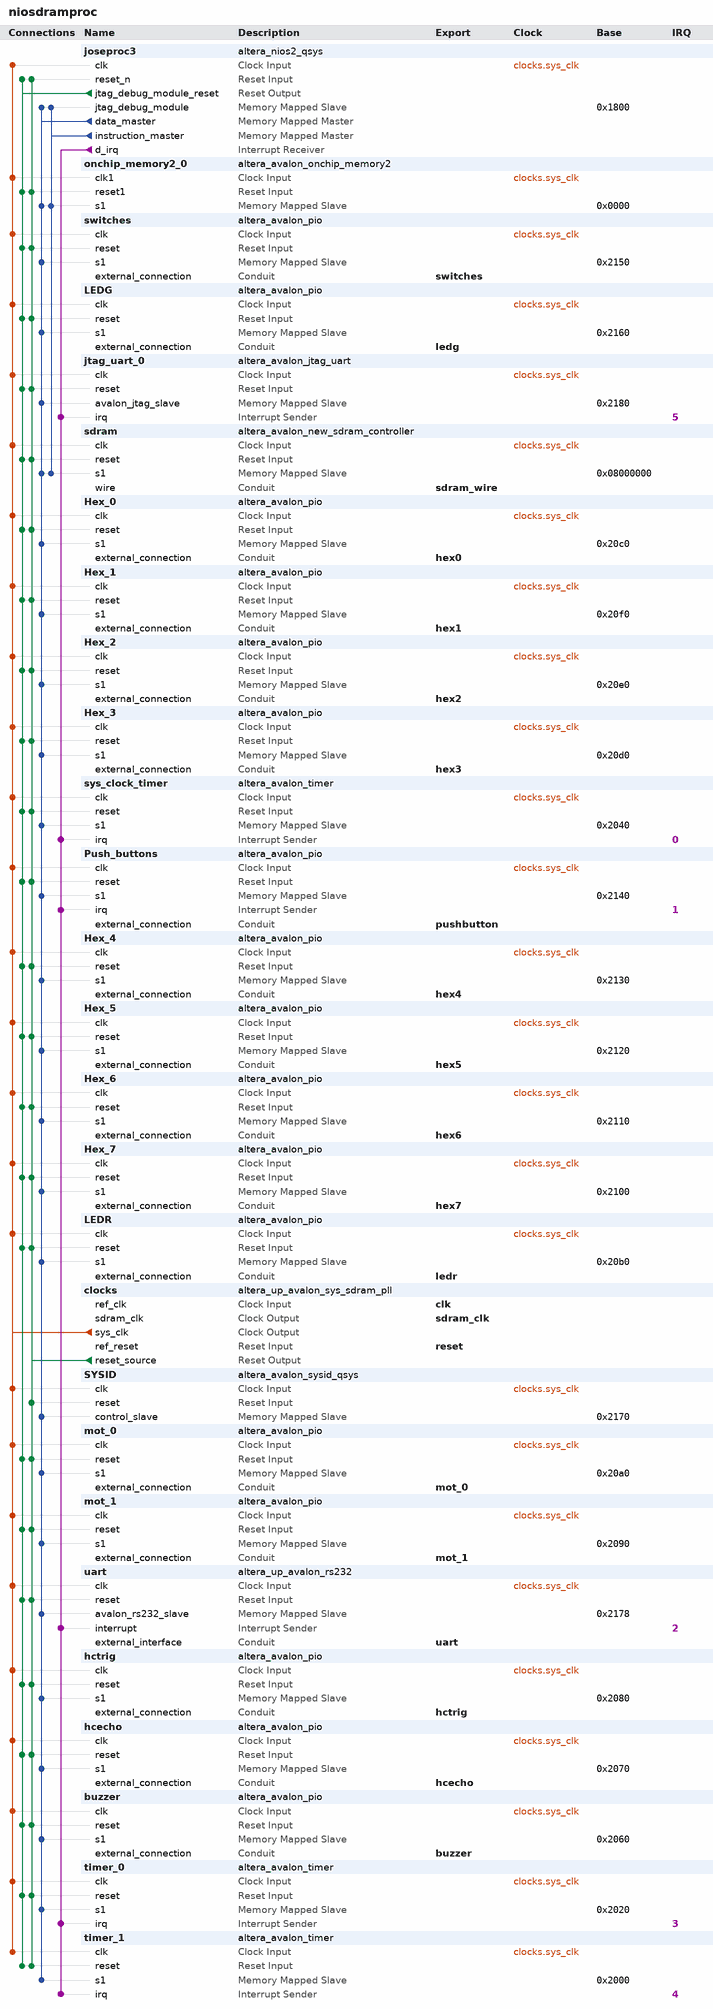
[diagram p0: system contents]
# Platform Designer (Qsys) system niosdramproc, Cyclone IV E EP4CE115F29C7
# Parameters at their usual value, and those the tool derives, are not listed.
package require -exact qsys 17.1
create_system niosdramproc
set_project_property DEVICE_FAMILY {Cyclone IV E}
set_project_property DEVICE EP4CE115F29C7

add_instance joseproc3 altera_nios2_qsys 16.1
set_instance_parameter_value joseproc3 breakSlave joseproc3.jtag_debug_module
set_instance_parameter_value joseproc3 exceptionSlave sdram.s1
set_instance_parameter_value joseproc3 icache_size 4096
set_instance_parameter_value joseproc3 impl Fast
set_instance_parameter_value joseproc3 mmu_TLBMissExcSlave None
set_instance_parameter_value joseproc3 resetSlave sdram.s1
set_instance_parameter_value joseproc3 resetrequest_enabled true

add_instance onchip_memory2_0 altera_avalon_onchip_memory2 17.1
set_instance_parameter_value onchip_memory2_0 dataWidth 32
set_instance_parameter_value onchip_memory2_0 dualPort false
set_instance_parameter_value onchip_memory2_0 initMemContent true
set_instance_parameter_value onchip_memory2_0 initializationFileName onchip_mem.hex
set_instance_parameter_value onchip_memory2_0 memorySize 4096

add_instance switches altera_avalon_pio 17.1
set_instance_parameter_value switches direction Input
set_instance_parameter_value switches width 18

add_instance LEDG altera_avalon_pio 17.1
set_instance_parameter_value LEDG direction Output
set_instance_parameter_value LEDG width 9

add_instance jtag_uart_0 altera_avalon_jtag_uart 17.1
set_instance_parameter_value jtag_uart_0 simInteractiveOptions NO_INTERACTIVE_WINDOWS

add_instance sdram altera_avalon_new_sdram_controller 17.1
set_instance_parameter_value sdram TAC 5.5
set_instance_parameter_value sdram TRCD 15.0
set_instance_parameter_value sdram TRP 15.0
set_instance_parameter_value sdram casLatency 3
set_instance_parameter_value sdram columnWidth 10
set_instance_parameter_value sdram dataWidth 32
set_instance_parameter_value sdram generateSimulationModel false
set_instance_parameter_value sdram model single_Micron_MT48LC4M32B2_7_chip
set_instance_parameter_value sdram numberOfBanks 4
set_instance_parameter_value sdram numberOfChipSelects 1
set_instance_parameter_value sdram powerUpDelay 100.0
set_instance_parameter_value sdram refreshPeriod 7.8125
set_instance_parameter_value sdram rowWidth 13

add_instance Hex_0 altera_avalon_pio 17.1
set_instance_parameter_value Hex_0 direction Output
set_instance_parameter_value Hex_0 width 7

add_instance Hex_1 altera_avalon_pio 17.1
set_instance_parameter_value Hex_1 direction Output
set_instance_parameter_value Hex_1 width 7

add_instance Hex_2 altera_avalon_pio 17.1
set_instance_parameter_value Hex_2 direction Output
set_instance_parameter_value Hex_2 width 7

add_instance Hex_3 altera_avalon_pio 17.1
set_instance_parameter_value Hex_3 direction Output
set_instance_parameter_value Hex_3 width 7

add_instance sys_clock_timer altera_avalon_timer 17.1
set_instance_parameter_value sys_clock_timer period 1
set_instance_parameter_value sys_clock_timer periodUnits MSEC

add_instance Push_buttons altera_avalon_pio 17.1
set_instance_parameter_value Push_buttons captureEdge true
set_instance_parameter_value Push_buttons direction Input
set_instance_parameter_value Push_buttons edgeType FALLING
set_instance_parameter_value Push_buttons generateIRQ true
set_instance_parameter_value Push_buttons irqType EDGE
set_instance_parameter_value Push_buttons width 4

add_instance Hex_4 altera_avalon_pio 17.1
set_instance_parameter_value Hex_4 direction Output
set_instance_parameter_value Hex_4 width 7

add_instance Hex_5 altera_avalon_pio 17.1
set_instance_parameter_value Hex_5 direction Output
set_instance_parameter_value Hex_5 width 7

add_instance Hex_6 altera_avalon_pio 17.1
set_instance_parameter_value Hex_6 direction Output
set_instance_parameter_value Hex_6 width 7

add_instance Hex_7 altera_avalon_pio 17.1
set_instance_parameter_value Hex_7 direction Output
set_instance_parameter_value Hex_7 width 7

add_instance LEDR altera_avalon_pio 17.1
set_instance_parameter_value LEDR direction Output
set_instance_parameter_value LEDR width 18

add_instance clocks altera_up_avalon_sys_sdram_pll 17.1
set_instance_parameter_value clocks CV_boards DE10-Standard
set_instance_parameter_value clocks gui_outclk 50.0
set_instance_parameter_value clocks gui_refclk 50.0

add_instance SYSID altera_avalon_sysid_qsys 17.1
set_instance_parameter_value SYSID id 0

add_instance mot_0 altera_avalon_pio 17.1
set_instance_parameter_value mot_0 direction Output
set_instance_parameter_value mot_0 width 4

add_instance mot_1 altera_avalon_pio 17.1
set_instance_parameter_value mot_1 direction Output
set_instance_parameter_value mot_1 width 4

add_instance uart altera_up_avalon_rs232 17.1
set_instance_parameter_value uart baud 9600
set_instance_parameter_value uart parity None

add_instance hctrig altera_avalon_pio 17.1
set_instance_parameter_value hctrig direction Output
set_instance_parameter_value hctrig width 1

add_instance hcecho altera_avalon_pio 17.1
set_instance_parameter_value hcecho direction Input
set_instance_parameter_value hcecho width 1

add_instance buzzer altera_avalon_pio 17.1
set_instance_parameter_value buzzer direction Output
set_instance_parameter_value buzzer width 1

add_instance timer_0 altera_avalon_timer 17.1
set_instance_parameter_value timer_0 period 1
set_instance_parameter_value timer_0 periodUnits MSEC

add_instance timer_1 altera_avalon_timer 17.1
set_instance_parameter_value timer_1 period 1
set_instance_parameter_value timer_1 periodUnits MSEC

# connections
add_connection clocks.sys_clk buzzer.clk clock
add_connection clocks.sys_clk hcecho.clk clock
add_connection clocks.sys_clk hctrig.clk clock
add_connection clocks.sys_clk Hex_0.clk clock
add_connection clocks.sys_clk Hex_1.clk clock
add_connection clocks.sys_clk Hex_2.clk clock
add_connection clocks.sys_clk Hex_3.clk clock
add_connection clocks.sys_clk Hex_4.clk clock
add_connection clocks.sys_clk Hex_5.clk clock
add_connection clocks.sys_clk Hex_6.clk clock
add_connection clocks.sys_clk Hex_7.clk clock
add_connection clocks.sys_clk joseproc3.clk clock
add_connection clocks.sys_clk jtag_uart_0.clk clock
add_connection clocks.sys_clk LEDG.clk clock
add_connection clocks.sys_clk LEDR.clk clock
add_connection clocks.sys_clk mot_0.clk clock
add_connection clocks.sys_clk mot_1.clk clock
add_connection clocks.sys_clk onchip_memory2_0.clk1 clock
add_connection clocks.sys_clk Push_buttons.clk clock
add_connection clocks.sys_clk sdram.clk clock
add_connection clocks.sys_clk switches.clk clock
add_connection clocks.sys_clk sys_clock_timer.clk clock
add_connection clocks.sys_clk SYSID.clk clock
add_connection clocks.sys_clk timer_0.clk clock
add_connection clocks.sys_clk timer_1.clk clock
add_connection clocks.sys_clk uart.clk clock
add_connection clocks.reset_source buzzer.reset reset
add_connection clocks.reset_source hcecho.reset reset
add_connection clocks.reset_source hctrig.reset reset
add_connection clocks.reset_source Hex_0.reset reset
add_connection clocks.reset_source Hex_1.reset reset
add_connection clocks.reset_source Hex_2.reset reset
add_connection clocks.reset_source Hex_3.reset reset
add_connection clocks.reset_source Hex_4.reset reset
add_connection clocks.reset_source Hex_5.reset reset
add_connection clocks.reset_source Hex_6.reset reset
add_connection clocks.reset_source Hex_7.reset reset
add_connection clocks.reset_source joseproc3.reset_n reset
add_connection clocks.reset_source jtag_uart_0.reset reset
add_connection clocks.reset_source LEDG.reset reset
add_connection clocks.reset_source LEDR.reset reset
add_connection clocks.reset_source mot_0.reset reset
add_connection clocks.reset_source mot_1.reset reset
add_connection clocks.reset_source onchip_memory2_0.reset1 reset
add_connection clocks.reset_source Push_buttons.reset reset
add_connection clocks.reset_source sdram.reset reset
add_connection clocks.reset_source switches.reset reset
add_connection clocks.reset_source sys_clock_timer.reset reset
add_connection clocks.reset_source SYSID.reset reset
add_connection clocks.reset_source timer_0.reset reset
add_connection clocks.reset_source timer_1.reset reset
add_connection clocks.reset_source uart.reset reset
add_connection joseproc3.jtag_debug_module_reset buzzer.reset reset
add_connection joseproc3.jtag_debug_module_reset hcecho.reset reset
add_connection joseproc3.jtag_debug_module_reset hctrig.reset reset
add_connection joseproc3.jtag_debug_module_reset Hex_0.reset reset
add_connection joseproc3.jtag_debug_module_reset Hex_1.reset reset
add_connection joseproc3.jtag_debug_module_reset Hex_2.reset reset
add_connection joseproc3.jtag_debug_module_reset Hex_3.reset reset
add_connection joseproc3.jtag_debug_module_reset Hex_4.reset reset
add_connection joseproc3.jtag_debug_module_reset Hex_5.reset reset
add_connection joseproc3.jtag_debug_module_reset Hex_6.reset reset
add_connection joseproc3.jtag_debug_module_reset Hex_7.reset reset
add_connection joseproc3.jtag_debug_module_reset joseproc3.reset_n reset
add_connection joseproc3.jtag_debug_module_reset jtag_uart_0.reset reset
add_connection joseproc3.jtag_debug_module_reset LEDG.reset reset
add_connection joseproc3.jtag_debug_module_reset LEDR.reset reset
add_connection joseproc3.jtag_debug_module_reset mot_0.reset reset
add_connection joseproc3.jtag_debug_module_reset mot_1.reset reset
add_connection joseproc3.jtag_debug_module_reset onchip_memory2_0.reset1 reset
add_connection joseproc3.jtag_debug_module_reset Push_buttons.reset reset
add_connection joseproc3.jtag_debug_module_reset sdram.reset reset
add_connection joseproc3.jtag_debug_module_reset switches.reset reset
add_connection joseproc3.jtag_debug_module_reset sys_clock_timer.reset reset
add_connection joseproc3.jtag_debug_module_reset timer_0.reset reset
add_connection joseproc3.jtag_debug_module_reset timer_1.reset reset
add_connection joseproc3.jtag_debug_module_reset uart.reset reset
add_connection joseproc3.data_master buzzer.s1 avalon
set_connection_parameter_value joseproc3.data_master/buzzer.s1 baseAddress 0x2060
add_connection joseproc3.data_master hcecho.s1 avalon
set_connection_parameter_value joseproc3.data_master/hcecho.s1 baseAddress 0x2070
add_connection joseproc3.data_master hctrig.s1 avalon
set_connection_parameter_value joseproc3.data_master/hctrig.s1 baseAddress 0x2080
add_connection joseproc3.data_master Hex_0.s1 avalon
set_connection_parameter_value joseproc3.data_master/Hex_0.s1 baseAddress 0x20c0
add_connection joseproc3.data_master Hex_1.s1 avalon
set_connection_parameter_value joseproc3.data_master/Hex_1.s1 baseAddress 0x20f0
add_connection joseproc3.data_master Hex_2.s1 avalon
set_connection_parameter_value joseproc3.data_master/Hex_2.s1 baseAddress 0x20e0
add_connection joseproc3.data_master Hex_3.s1 avalon
set_connection_parameter_value joseproc3.data_master/Hex_3.s1 baseAddress 0x20d0
add_connection joseproc3.data_master Hex_4.s1 avalon
set_connection_parameter_value joseproc3.data_master/Hex_4.s1 baseAddress 0x2130
add_connection joseproc3.data_master Hex_5.s1 avalon
set_connection_parameter_value joseproc3.data_master/Hex_5.s1 baseAddress 0x2120
add_connection joseproc3.data_master Hex_6.s1 avalon
set_connection_parameter_value joseproc3.data_master/Hex_6.s1 baseAddress 0x2110
add_connection joseproc3.data_master Hex_7.s1 avalon
set_connection_parameter_value joseproc3.data_master/Hex_7.s1 baseAddress 0x2100
add_connection joseproc3.data_master joseproc3.jtag_debug_module avalon
set_connection_parameter_value joseproc3.data_master/joseproc3.jtag_debug_module baseAddress 0x1800
add_connection joseproc3.data_master jtag_uart_0.avalon_jtag_slave avalon
set_connection_parameter_value joseproc3.data_master/jtag_uart_0.avalon_jtag_slave baseAddress 0x2180
add_connection joseproc3.data_master LEDG.s1 avalon
set_connection_parameter_value joseproc3.data_master/LEDG.s1 baseAddress 0x2160
add_connection joseproc3.data_master LEDR.s1 avalon
set_connection_parameter_value joseproc3.data_master/LEDR.s1 baseAddress 0x20b0
add_connection joseproc3.data_master mot_0.s1 avalon
set_connection_parameter_value joseproc3.data_master/mot_0.s1 baseAddress 0x20a0
add_connection joseproc3.data_master mot_1.s1 avalon
set_connection_parameter_value joseproc3.data_master/mot_1.s1 baseAddress 0x2090
add_connection joseproc3.data_master onchip_memory2_0.s1 avalon
set_connection_parameter_value joseproc3.data_master/onchip_memory2_0.s1 baseAddress 0x0000
add_connection joseproc3.data_master Push_buttons.s1 avalon
set_connection_parameter_value joseproc3.data_master/Push_buttons.s1 baseAddress 0x2140
add_connection joseproc3.data_master sdram.s1 avalon
set_connection_parameter_value joseproc3.data_master/sdram.s1 baseAddress 0x08000000
add_connection joseproc3.data_master switches.s1 avalon
set_connection_parameter_value joseproc3.data_master/switches.s1 baseAddress 0x2150
add_connection joseproc3.data_master sys_clock_timer.s1 avalon
set_connection_parameter_value joseproc3.data_master/sys_clock_timer.s1 baseAddress 0x2040
add_connection joseproc3.data_master SYSID.control_slave avalon
set_connection_parameter_value joseproc3.data_master/SYSID.control_slave baseAddress 0x2170
add_connection joseproc3.data_master timer_0.s1 avalon
set_connection_parameter_value joseproc3.data_master/timer_0.s1 baseAddress 0x2020
add_connection joseproc3.data_master timer_1.s1 avalon
set_connection_parameter_value joseproc3.data_master/timer_1.s1 baseAddress 0x2000
add_connection joseproc3.data_master uart.avalon_rs232_slave avalon
set_connection_parameter_value joseproc3.data_master/uart.avalon_rs232_slave baseAddress 0x2178
add_connection joseproc3.instruction_master joseproc3.jtag_debug_module avalon
set_connection_parameter_value joseproc3.instruction_master/joseproc3.jtag_debug_module baseAddress 0x1800
add_connection joseproc3.instruction_master onchip_memory2_0.s1 avalon
set_connection_parameter_value joseproc3.instruction_master/onchip_memory2_0.s1 baseAddress 0x0000
add_connection joseproc3.instruction_master sdram.s1 avalon
set_connection_parameter_value joseproc3.instruction_master/sdram.s1 baseAddress 0x08000000
add_connection joseproc3.d_irq jtag_uart_0.irq interrupt
set_connection_parameter_value joseproc3.d_irq/jtag_uart_0.irq irqNumber 5
add_connection joseproc3.d_irq Push_buttons.irq interrupt
set_connection_parameter_value joseproc3.d_irq/Push_buttons.irq irqNumber 1
add_connection joseproc3.d_irq sys_clock_timer.irq interrupt
set_connection_parameter_value joseproc3.d_irq/sys_clock_timer.irq irqNumber 0
add_connection joseproc3.d_irq timer_0.irq interrupt
set_connection_parameter_value joseproc3.d_irq/timer_0.irq irqNumber 3
add_connection joseproc3.d_irq timer_1.irq interrupt
set_connection_parameter_value joseproc3.d_irq/timer_1.irq irqNumber 4
add_connection joseproc3.d_irq uart.interrupt interrupt
set_connection_parameter_value joseproc3.d_irq/uart.interrupt irqNumber 2

# exported interfaces
add_interface buzzer conduit end
set_interface_property buzzer EXPORT_OF buzzer.external_connection
add_interface clk clock sink
set_interface_property clk EXPORT_OF clocks.ref_clk
add_interface hcecho conduit end
set_interface_property hcecho EXPORT_OF hcecho.external_connection
add_interface hctrig conduit end
set_interface_property hctrig EXPORT_OF hctrig.external_connection
add_interface hex0 conduit end
set_interface_property hex0 EXPORT_OF Hex_0.external_connection
add_interface hex1 conduit end
set_interface_property hex1 EXPORT_OF Hex_1.external_connection
add_interface hex2 conduit end
set_interface_property hex2 EXPORT_OF Hex_2.external_connection
add_interface hex3 conduit end
set_interface_property hex3 EXPORT_OF Hex_3.external_connection
add_interface hex4 conduit end
set_interface_property hex4 EXPORT_OF Hex_4.external_connection
add_interface hex5 conduit end
set_interface_property hex5 EXPORT_OF Hex_5.external_connection
add_interface hex6 conduit end
set_interface_property hex6 EXPORT_OF Hex_6.external_connection
add_interface hex7 conduit end
set_interface_property hex7 EXPORT_OF Hex_7.external_connection
add_interface ledg conduit end
set_interface_property ledg EXPORT_OF LEDG.external_connection
add_interface ledr conduit end
set_interface_property ledr EXPORT_OF LEDR.external_connection
add_interface mot_0 conduit end
set_interface_property mot_0 EXPORT_OF mot_0.external_connection
add_interface mot_1 conduit end
set_interface_property mot_1 EXPORT_OF mot_1.external_connection
add_interface pushbutton conduit end
set_interface_property pushbutton EXPORT_OF Push_buttons.external_connection
add_interface reset reset sink
set_interface_property reset EXPORT_OF clocks.ref_reset
add_interface sdram_clk clock source
set_interface_property sdram_clk EXPORT_OF clocks.sdram_clk
add_interface sdram_wire conduit end
set_interface_property sdram_wire EXPORT_OF sdram.wire
add_interface switches conduit end
set_interface_property switches EXPORT_OF switches.external_connection
add_interface uart conduit end
set_interface_property uart EXPORT_OF uart.external_interface

set_interconnect_requirement {$system} qsys_mm.clockCrossingAdapter HANDSHAKE
set_interconnect_requirement {$system} qsys_mm.enableEccProtection FALSE
set_interconnect_requirement {$system} qsys_mm.insertDefaultSlave FALSE
set_interconnect_requirement {$system} qsys_mm.maxAdditionalLatency 1

save_system niosdramproc.qsys
